# EAGLE design BluCoLight (EAGLE 6.5.0)
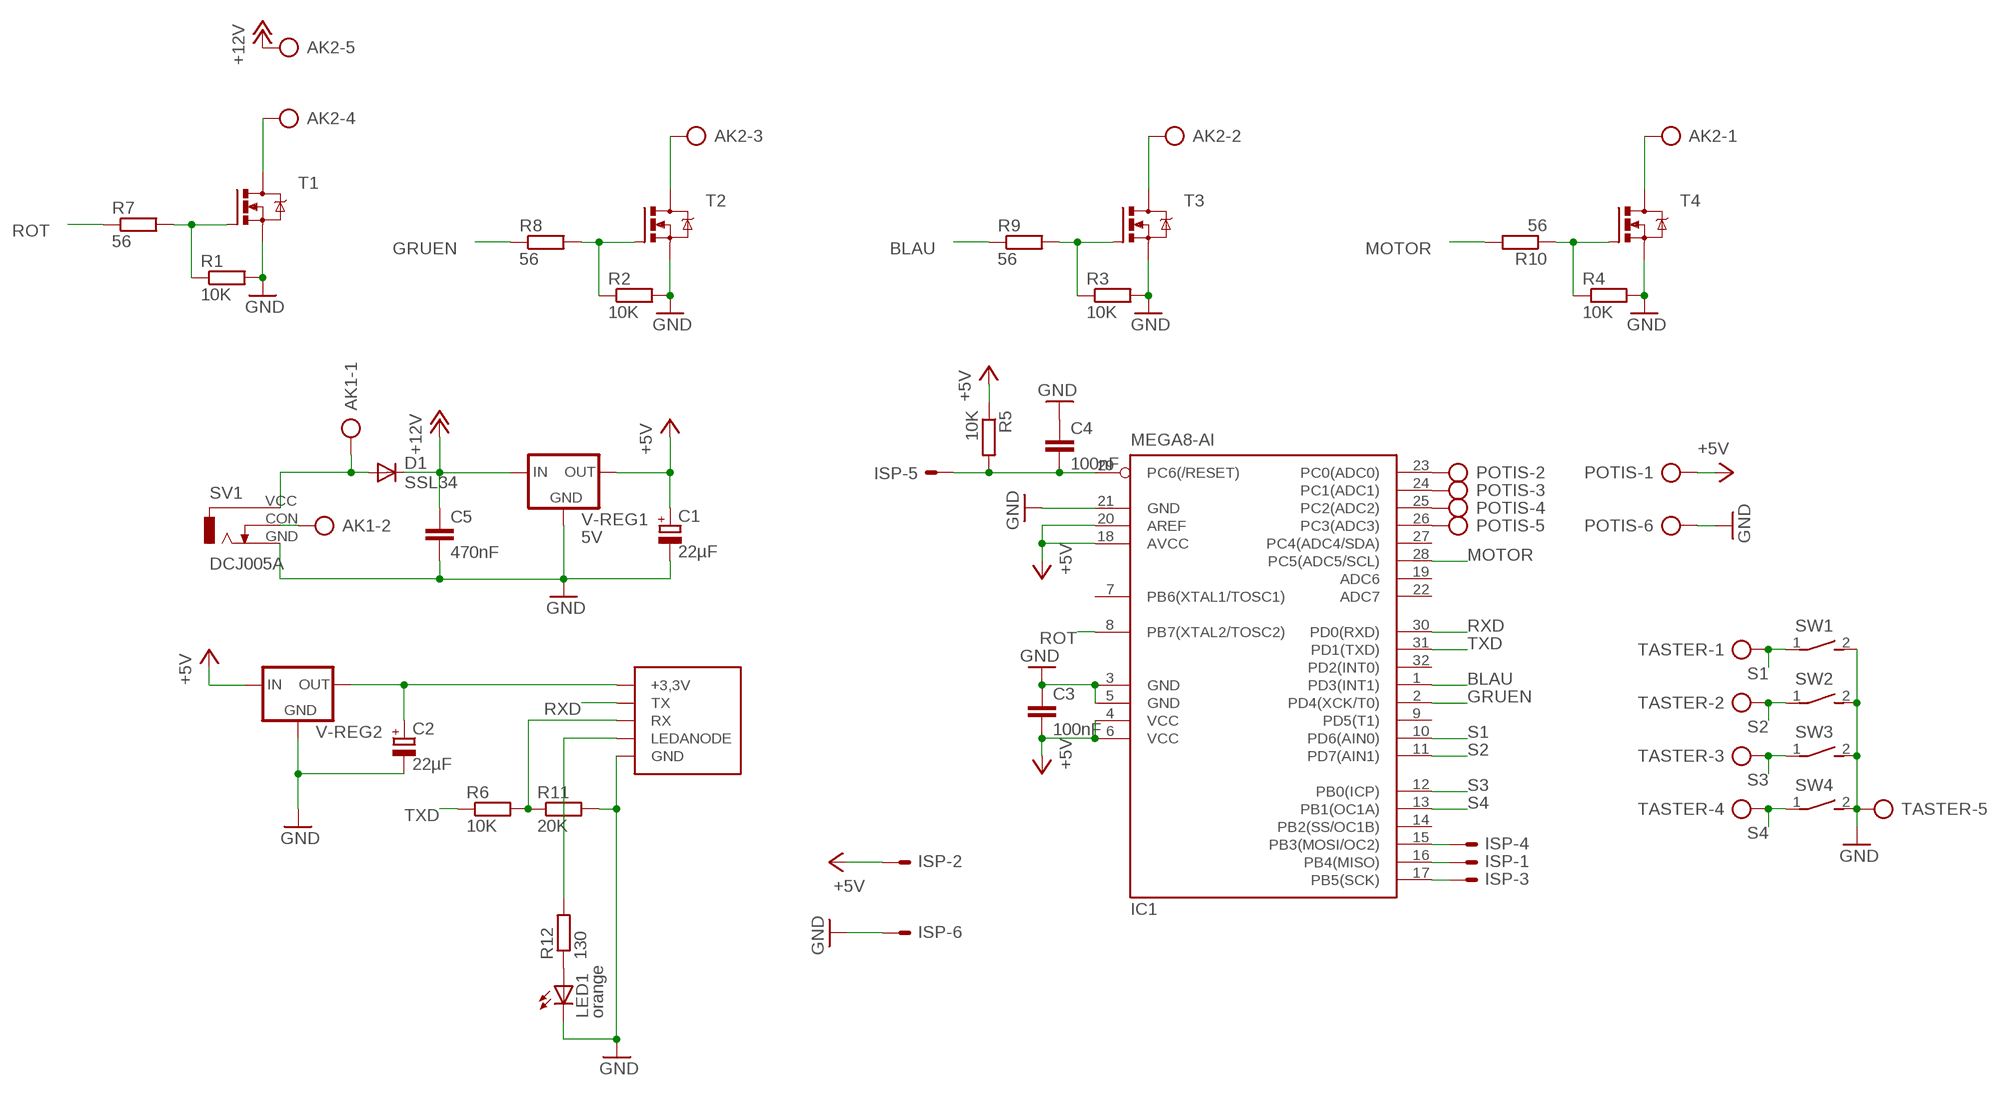
[diagram p0: schematic, sheet 1]

## Parts
AK1  AK2  [AK/2]
AK2  AK5AK/5  [AK/5]
C1  22µF  CPOL-EU153CLV-0605  [153CLV-0605]
C2  22µF  CPOL-EU153CLV-0605  [153CLV-0605]
C3  100nF  C-EUC0805K  [C0805K]
C4  100nF  C-EUC0805K  [C0805K]
C5  470nF  C-EUC1210K  [C1210K]
D1  SSL34  DIODE-SMC  [SMC]
HC-06  HC-06  [HC-06SMD]
IC1  MEGA8-AI  [TQFP32-08]
ISP  ML6E  [ML6]
LED1  orange  LEDCHIP-LED0603  [CHIP-LED0603]
POTIS  AK6PAD/6  [PAD/6]
R1  10K  R-EUR0603  [R0603]
R2  10K  R-EUR0603  [R0603]
R3  10K  R-EUR0603  [R0603]
R4  10K  R-EUR0603  [R0603]
R5  10K  R-EUR0603  [R0603]
R6  10K  R-EUR0603  [R0603]
R7  56  R-EUR0603  [R0603]
R8  56  R-EUR0603  [R0603]
R9  56  R-EUR0603  [R0603]
R10  56  R-EUR0603  [R0603]
R11  20K  R-EUR0603  [R0603]
R12  130  R-EUR0603  [R0603]
SV1  DCJ005A  [DC005A]
SW1  TASTER36SMD  [3*6*2.5SMD_TASTER]
SW2  TASTER36SMD  [3*6*2.5SMD_TASTER]
SW3  TASTER36SMD  [3*6*2.5SMD_TASTER]
SW4  TASTER36SMD  [3*6*2.5SMD_TASTER]
T1  IRLZ34NSPBFD2PACK  [D2PACK]
T2  IRLZ34NSPBFD2PACK  [D2PACK]
T3  IRLZ34NSPBFD2PACK  [D2PACK]
T4  IRLZ34NSPBFD2PACK  [D2PACK]
TASTER  AK5PAD/5  [PAD/5]
V-REG1  5V  53AP_L53B(LM2940CT5-SOT223)  [SOT223]
V-REG2  AMS1117-3.3SOT223  [SOT223]

## Nets
+5V: C1.+ C3.2 IC1.4(VCC) IC1.6(VCC) IC1.18(AVCC) IC1.20(AREF) ISP.2 POTIS.1 R5.1 V-REG1.3(OUT) V-REG2.3(IN)
+12V: AK2.5 C5.1 D1.C V-REG1.1(IN)
BLAU: IC1.1(PD3(INT1)) R9.1
GND: C1.- C2.- C3.1 C4.1 C5.2 HC-06.P$13(GND) HC-06.P$21(GND) HC-06.P$22(GND) IC1.3(GND) IC1.5(GND) IC1.21(GND) ISP.6 LED1.C POTIS.6 R1.2 R2.2 R3.2 R4.2 R11.2 SV1.GND SW1.2(S) SW2.2(S) SW3.2(S) SW4.2(S) T1.3(S) T2.3(S) T3.3(S) T4.3(S) TASTER.5 V-REG1.2(GND) V-REG1.4(GND) V-REG2.1(GND)
GRUEN: IC1.2(PD4(XCK/T0)) R8.1
MOTOR: IC1.28(PC5(ADC5/SCL)) R10.2
N$1: HC-06.P$24(LEDANODE) R12.2
N$2: C4.2 IC1.29(PC6(/RESET)) ISP.5 R5.2
N$3: R2.1 R8.2 T2.1(G)
N$4: IC1.15(PB3(MOSI/OC2)) ISP.4
N$5: R1.1 R7.2 T1.1(G)
N$6: AK2.4 T1.2(D)
N$7: AK2.3 T2.2(D)
N$8: R4.1 R10.1 T4.1(G)
N$9: IC1.16(PB4(MISO)) ISP.1
N$10: R3.1 R9.2 T3.1(G)
N$11: AK2.2 T3.2(D)
N$12: IC1.17(PB5(SCK)) ISP.3
N$13: AK2.1 T4.2(D)
N$14: HC-06.P$2(RX) R6.2 R11.1
N$15: LED1.A R12.1
N$16: IC1.23(PC0(ADC0)) POTIS.2
N$17: IC1.24(PC1(ADC1)) POTIS.3
N$18: C2.+ HC-06.P$12(+3,3V) V-REG2.2(OUT) V-REG2.4(OUT)
N$19: IC1.25(PC2(ADC2)) POTIS.4
N$20: IC1.26(PC3(ADC3)) POTIS.5
N$21: AK1.2 SV1.CON
N$25: AK1.1 D1.A SV1.VCC
ROT: IC1.8(PB7(XTAL2/TOSC2)) R7.1
RXD: HC-06.P$1(TX) IC1.30(PD0(RXD))
S1: IC1.10(PD6(AIN0)) SW1.1(P) TASTER.1
S2: IC1.11(PD7(AIN1)) SW2.1(P) TASTER.2
S3: IC1.12(PB0(ICP)) SW3.1(P) TASTER.3
S4: IC1.13(PB1(OC1A)) SW4.1(P) TASTER.4
TXD: IC1.31(PD1(TXD)) R6.1
Unconnected: IC1.7(PB6(XTAL1/TOSC1)) IC1.9(PD5(T1)) IC1.14(PB2(SS/OC1B)) IC1.19(ADC6) IC1.22(ADC7) IC1.27(PC4(ADC4/SDA)) IC1.32(PD2(INT0))

## Library data of the parts
AK1 = !Häufige Bauteile:AK2
AK2 TASTER = !Häufige Bauteile:AK5
C1 C2 = rcl:CPOL-EU: POLARIZED CAPACITOR, European symbol
C3-C5 = rcl:C-EU: CAPACITOR, European symbol
D1 = diode:DIODE-: DIODE
HC-06 = !Eigene Library SMD:HC-06
IC1 = atmel:MEGA8: MICROCONTROLLER 8 Kbytes FLASH, 1 kbytes SRAM, 512 bytes EEPROM, USART, 6-channel 10 bit ADC, 2-channel 8 bit ADC Pin compatible with Atmega48, ATMega88, ATMega168 Source: avr.lbr; MPN: ATMEGA8-16AU; OC_FARNELL: 9171371; OC_NEWARK: 73M8863
ISP = !Eigene Library SMD:ML6E
LED1 = led:LED: LED OSRAM: - CHIPLED LG R971, LG N971, LY N971, LG Q971, LY Q971, LO R971, LY R971 LH N974, LH R974 LS Q976, LO Q976, LY Q976 LO Q996 - Hyper CHIPLED LW Q18S LB Q993, LB Q99A, LB R99A - SideLED LS A670, LO A670, LY A670, LG A670, LP A670 LB A673, LV A673, LT A673, LW A673 LH A674 LY A675 LS A676, LA A676, LO A676, LY A676, LW A676 LS A679, LY A679, LG A679 - Hyper Micro SIDELED® LS Y876, LA Y876, LO Y876, LY Y876 LT Y87S - SmartLED LW L88C, LW L88S LB L89C, LB L89S, LG L890 LS L89K, LO L89K, LY L89K LS L896, LA L896, LO L896, LY L896 - TOPLED LS T670, LO T670, LY T670, LG T670, LP T670 LSG T670, LSP T670, LSY T670, LOP T670, LYG T670 LG T671, LOG T671, LSG T671 LB T673, LV T673, LT T673, LW T673 LH T674 LS T676, LA T676, LO T676, LY T676, LB T676, LH T676, LSB T676, LW T676 LB T67C, LV T67C, LT T67C, LS T67K, LO T67K, LY T67K, LW E67C LS E67B, LA E67B, LO E67B, LY E67B, LB E67C, LV E67C, LT E67C LW T67C LS T679, LY T679, LG T679 LS T770, LO T770, LY T770, LG T770, LP T770 LB T773, LV T773, LT T773, LW T773 LH T774 LS E675, LA E675, LY E675, LS T675 LS T776, LA T776, LO T776, LY T776, LB T776 LHGB T686 LT T68C, LB T68C - Hyper Mini TOPLED® LB M676 - Mini TOPLED Santana® LG M470 LS M47K, LO M47K, LY M47K Source: http://www.osram.convergy.de LUXEON: - LUMILED® LXK2-PW12-R00, LXK2-PW12-S00, LXK2-PW14-U00, LXK2-PW14-V00 LXK2-PM12-R00, LXK2-PM12-S00, LXK2-PM14-U00 LXK2-PE12-Q00, LXK2-PE12-R00, LXK2-PE12-S00, LXK2-PE14-T00, LXK2-PE14-U00 LXK2-PB12-K00, LXK2-PB12-L00, LXK2-PB12-M00, LXK2-PB14-N00, LXK2-PB14-P00, LXK2-PB14-Q00 LXK2-PR12-L00, LXK2-PR12-M00, LXK2-PR14-Q00, LXK2-PR14-R00 LXK2-PD12-Q00, LXK2-PD12-R00, LXK2-PD12-S00 LXK2-PH12-R00, LXK2-PH12-S00 LXK2-PL12-P00, LXK2-PL12-Q00, LXK2-PL12-R00 Source: www.luxeon.com KINGBRIGHT: KA-3528ASYC Source: www.kingbright.com
POTIS = !Häufige Bauteile:AK6
R1-R12 = !Eigene Library SMD:R-EU
SV1 = !Häufige Bauteile:DCJ005A: DC POWER JACK Source: DCJ0202.pdf; OC_FARNELL: unknown; OC_NEWARK: unknown
SW1-SW4 = !Eigene Library SMD:TASTER3*6SMD
T1-T4 = !Eigene Library SMD:IRLZ34NSPBF: IRLZ34 im D²PAK Gehäuse logic Level n-channel Mosfet Schaltet bei 12V max 2A
V-REG1 = !Eigene Library SMD:53AP_L53B(LM2940CT5-SOT223)
V-REG2 = !Eigene Library SMD:AMS1117-3.3SOT223

## Board
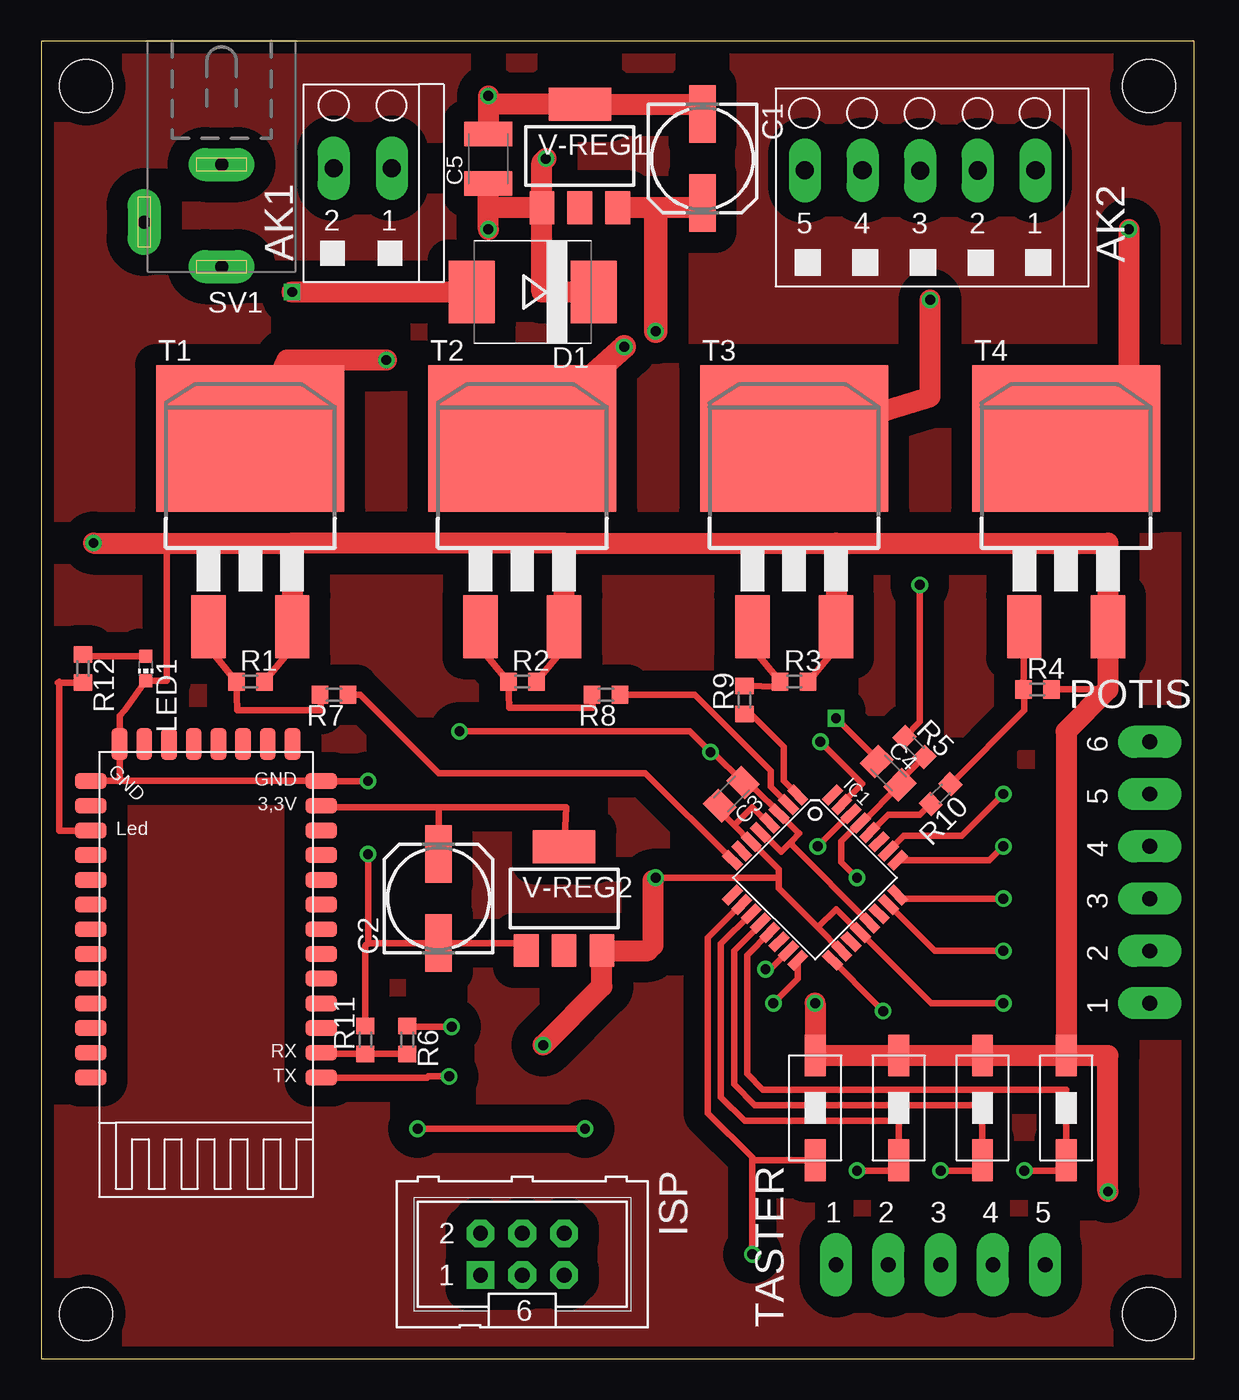
[diagram p1: board, top side]
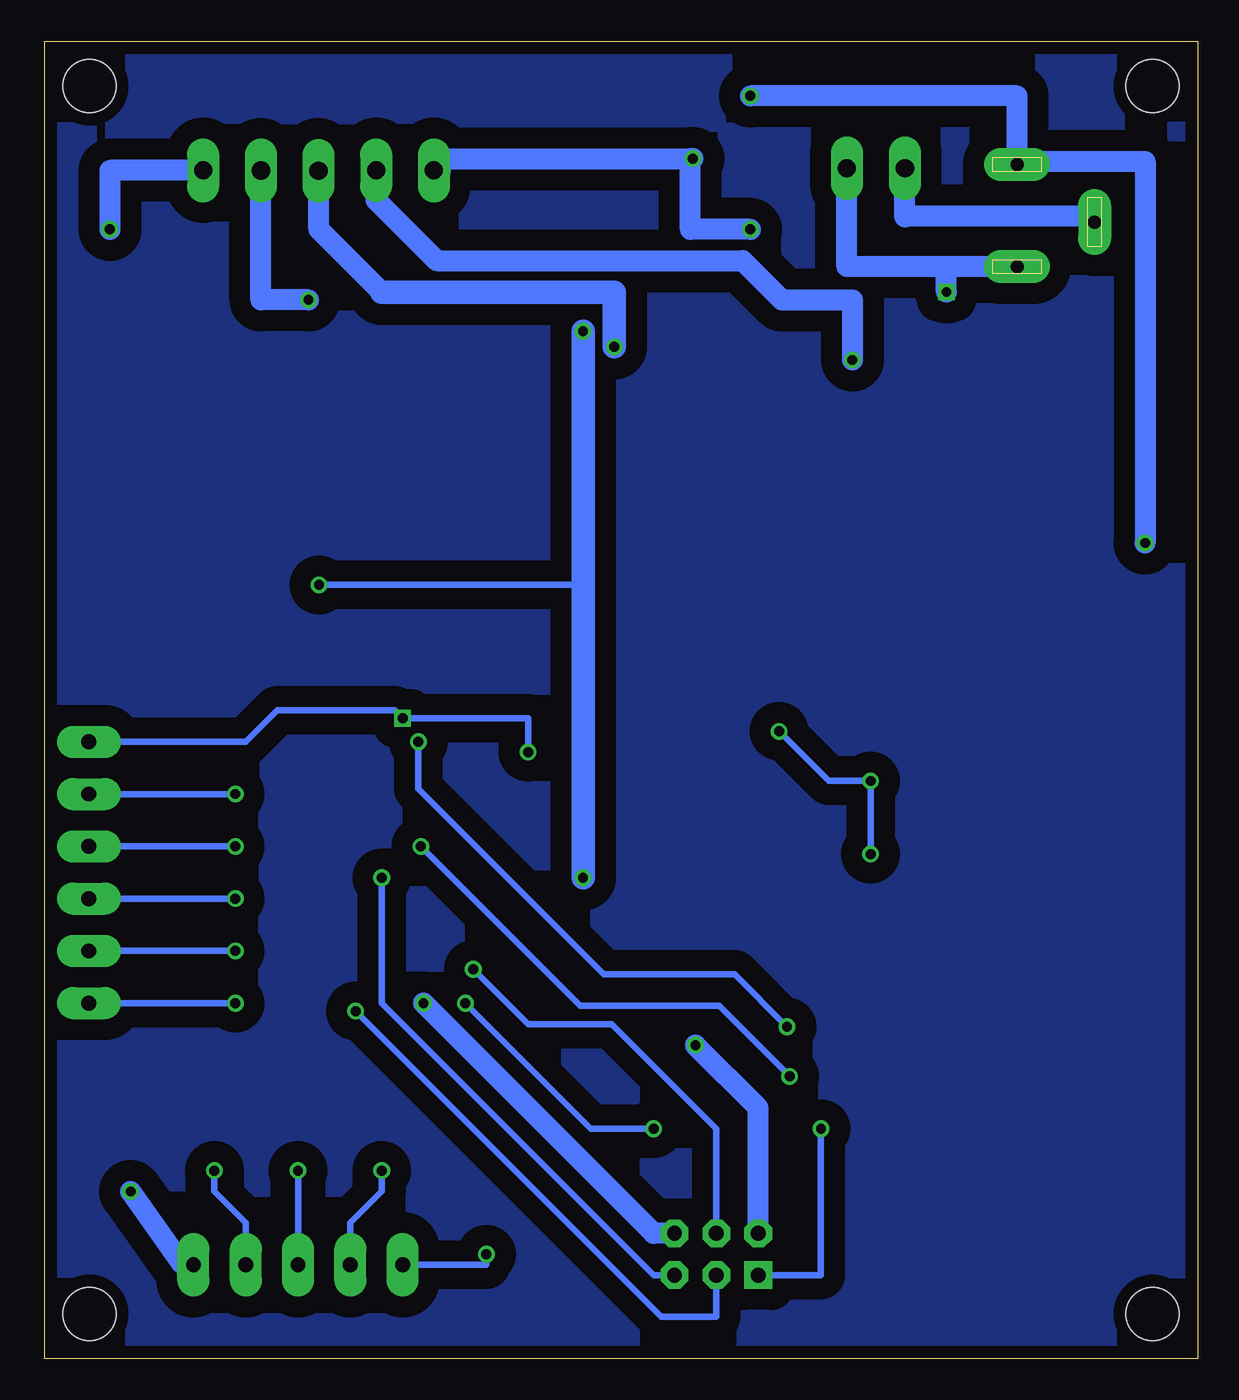
[diagram p2: board, bottom side, seen from below]

Size 70 x 80 mm. Coordinates in mm from the lower left corner, seen from the top.
Outline: 0,0 70,0 70,80 0,80 0,0
Copper layers (1*16): Top 0.035mm / dielectric 1.5mm / Bottom 0.035mm
Design rules "default *": minimum track width 10mil, minimum drill 23mil, track to track 50mil, track to pad 50mil, pad to pad 50mil, via to via 50mil, smd to smd 50mil, copper to edge 30mil, drill to drill 8mil, minimum pad ring 10mil, minimum via ring 8mil, stop-mask expansion 4mil, vias tented up to drill 0mil, thermal gap 10mil
Holes 3.2 mm at 2.73,77.27 67.27,77.27 67.27,2.73 2.73,2.73

### Footprints (pad centres in the part's own frame; a part is rotated, then mirrored left to right if it is on the bottom)
AK/2 = drill 1.1 pad 1.93 long: 1 1.605,1.17; 2 -1.925,1.17
AK/5 = drill 1.1 pad 1.93 long: 1 7.029,1.035; 2 3.521,1.025; 3 0.03,1.018; 4 -3.473,1.038; 5 -6.979,1.035
153CLV-0605 = smd 3.5 x 1.6: + 2.7,0; - -2.7,0
C0805K = smd 1.3 x 1.6: 1 -1,0; 2 1,0
C1210K = smd 1.5 x 2.9: 1 -1.5,0; 2 1.5,0
SMC = smd 2.8 x 3.8: A 3.7,0; C -3.7,0
HC-06SMD = smd 1.93 x 0.965: P$1 -6.85,8.32; P$2 -6.85,6.82; P$3 -6.85,5.32; P$4 -6.85,3.82; P$5 -6.85,2.32; P$6 -6.85,0.82; P$7 -6.85,-0.68; P$8 -6.85,-2.18; P$9 -6.85,-3.68; P$10 -6.85,-5.18; P$11 -6.85,-6.68; P$12 -6.85,-8.18; P$13 -6.85,-9.68; P$22 7.15,-9.68; P$23 7.15,-8.18; P$24 7.15,-6.68; P$25 7.15,-5.18; P$26 7.15,-3.68; P$27 7.15,-2.18; P$28 7.15,-0.68; P$29 7.15,0.82; P$30 7.15,2.32; P$31 7.15,3.82; P$32 7.15,5.32; P$33 7.15,6.82; P$34 7.15,8.32 | smd 0.965 x 1.93: P$14 -5.1,-11.93; P$15 -3.6,-11.93; P$16 -2.1,-11.93; P$17 -0.6,-11.93; P$18 0.9,-11.93; P$19 2.4,-11.93; P$20 3.9,-11.93; P$21 5.4,-11.93
TQFP32-08 = smd 1.27 x 0.559: 1 -4.293,2.8; 2 -4.293,2; 3 -4.293,1.2; 4 -4.293,0.4; 5 -4.293,-0.4; 6 -4.293,-1.2; 7 -4.293,-2; 8 -4.293,-2.8; 17 4.293,-2.8; 18 4.293,-2; 19 4.293,-1.2; 20 4.293,-0.4; 21 4.293,0.4; 22 4.293,1.2; 23 4.293,2; 24 4.293,2.8 | smd 0.559 x 1.27: 9 -2.8,-4.293; 10 -2,-4.293; 11 -1.2,-4.293; 12 -0.4,-4.293; 13 0.4,-4.293; 14 1.2,-4.293; 15 2,-4.293; 16 2.8,-4.293; 25 2.8,4.293; 26 2,4.293; 27 1.2,4.293; 28 0.4,4.293; 29 -0.4,4.293; 30 -1.2,4.293; 31 -2,4.293; 32 -2.8,4.293
ML6 = drill 0.9 pad 1.676 square: 1 -2.54,-1.27 | drill 0.9 pad 1.676 octagon: 2 -2.54,1.27; 3 0,-1.27; 4 0,1.27; 5 2.54,-1.27; 6 2.54,1.27
CHIP-LED0603 = smd 0.8 x 0.8: A 0,-0.75; C 0,0.75
PAD/6 = drill 0.9 pad 1.93 long: 1 -7.62,0; 2 -4.445,0; 3 -1.27,0; 4 1.905,0; 5 5.08,0; 6 8.255,0
R0603 = smd 1 x 1.1: 1 -0.85,0; 2 0.85,0
DC005A = drill 0.8 pad 2 long: CON 4.7,4.65; GND 0,1.15; VCC 0,7.35
3*6*2.5SMD_TASTER = smd 1.27 x 2.54: 1 0,-3.175; 2 0,3.175
D2PACK = smd 2.083 x 3.81: 1 -2.54,-8.89; 3 2.54,-8.89 | smd 11.43 x 8.89: 2 0,2.54
PAD/5 = drill 0.9 pad 1.93 long: 1 -6.35,0; 2 -3.175,0; 3 0,0; 4 3.175,0; 5 6.35,0
SOT223 = smd 1.5 x 2: 1 -2.3,-3.15; 2 0,-3.15; 3 2.3,-3.15 | smd 3.8 x 2: 4 0,3.15

### Placement (x,y rotation side)
AK1  19.68,71.12 0 top
AK2  53.34,71.12 0 top
C1  40.15,72.87 270 top
C2  24.13,27.94 90 top
C3  41.91,34.29 225 top
C4  51.44,35.56 315 top
C5  27.15,72.87 90 top
D1  29.84,64.77 180 top
HC-06  10.16,25.4 180 top
IC1  46.99,29.21 315 top
ISP  29.21,6.35 0 top
LED1  6.35,41.91 180 top
POTIS  67.31,29.21 90 top
R1  12.7,41.12 0 top
R2  29.21,41.12 0 top
R3  45.72,41.12 0 top
R4  60.48,40.64 0 top
R5  53.02,37.15 315 top
R6  22.23,19.37 270 top
R7  17.78,40.32 180 top
R8  34.29,40.32 180 top
R9  42.7,40.01 90 top
R10  54.61,34.29 225 top
R11  19.68,19.37 90 top
R12  2.54,41.91 270 top
SV1  10.95,73.66 180 top
SW1  46.99,15.24 0 top
SW2  52.07,15.24 0 top
SW3  57.15,15.24 0 top
SW4  62.23,15.24 0 top
T1  12.7,53.34 0 top
T2  29.21,53.34 0 top
T3  45.72,53.34 0 top
T4  62.23,53.34 0 top
TASTER  54.61,5.71 0 top
V-REG1  32.7,73.03 0 top
V-REG2  31.75,27.94 0 top

### Tracks (layer width: path | path; a pad name or v marks a point on that pad's centre or on a via)
+5V  (via drill 0.6)
  Top 0.406: 44.31,32.53 IC1.4 44.15,32.53 43.18,33.5 42.07,32.38 | IC1.18 48.58,24.76 47.15,26.19 | 47.15,26.19 44.77,28.57 44.77,29.21 | 44.77,29.21 44.77,29.73 IC1.6 43.06,31.4 42.07,32.38 | 47.15,26.19 48.26,27.3 49.67,25.89 IC1.20 54.04,21.59 v58.42,21.59 | 42.07,32.38 41.43,33.02 41.43,33.35 C3.2 | v37.31,29.21 44.77,29.21 | R5.1 53.34,38.67 v53.34,46.99
  Top 1.016: 36.85,24.79 37.15,25.08 | 37.15,29.05 v37.31,29.21
  Top 1.27: 36.85,24.79 V-REG2.3 34.05,22.62 v30.48,19.05 | 37.15,25.08 37.15,29.05 | 37.3,69.7 37.3,69.88 | 37.3,69.88 V-REG1.3 | C1.+ 40.15,69.88 37.3,69.88
  Top 1.422: 37.3,69.7 37.31,68.9 v37.31,62.39
  Bottom 0.406: POTIS.1 v58.42,21.59 | v53.34,46.99 37.31,46.99
  Bottom 1.27: ISP.2 26.67,15.24 v30.48,19.05
  Bottom 1.422: v37.31,62.39 37.31,46.99 v37.31,29.21
+12V  (via drill 0.6)
  Top 1.27: V-REG1.1 27.15,69.88 | 27.15,69.88 C5.1 | v27.15,68.58 27.15,69.88 | V-REG1.1 30.4,72.63 v30.64,72.87 | D1.C 30.4,64.77 V-REG1.1
  Bottom 1.27: AK2.5 45.95,72.16 45.88,72.87 30.8,72.87 | v30.64,72.87 30.8,72.87 | v27.15,68.58 30.8,68.58 30.8,72.87
BLAU
  Top 0.406: IC1.1 45.09,35.08 45.09,37.15 43.02,39.21 43.02,39.16 R9.1
GND  (via drill 0.6)
  Top 0.406: R4.2 64.77,40.64 | R3.2 48.26,43.18 T3.3 | C4.1 50.73,36.43 v48.26,38.89 | R2.2 31.75,43.18 T2.3 | R1.2 15.24,43.18 T1.3 | V-REG2.1 29,25.24 C2.- | 19.84,25.24 C2.- | C2.- 19.84,25.24 | 19.84,25.24 v19.84,30.64 | v19.84,35.08 HC-06.P$13 | HC-06.P$21 4.76,36.06 | 4.76,36.06 4.76,39.05 5.08,39.37 LED1.C 7.62,41.16 7.62,49.53 | R11.2 19.68,25.08 19.84,25.24 | 62.23,23.34 62.23,19.05 SW4.2 | 16.99,35.08 4.76,35.08 | 2.7,35.08 4.76,35.08 | 4.76,35.08 4.76,36.06 | IC1.5 43.76,31.96 44.93,30.8 45.56,31.43 | 45.56,31.43 46.04,31.91 45.99,31.91 IC1.3 44.8,33.14 43.34,34.61 43.01,34.61 C3.1 40.78,36.83 v40.64,36.83 39.37,38.1 v25.4,38.1 | 45.56,31.43 45.56,31.2 IC1.21
  Top 1.27: v64.77,10.16 64.77,18.41 SW4.2 SW3.2 SW2.2 SW1.2 v46.99,21.59 | v27.15,76.68 27.15,76.17 | 27.15,76.17 C5.2 | 27.15,76.17 V-REG1.4 40.15,76.17 C1.- | v3.17,49.53 7.62,49.53 15.24,49.53 | T2.3 31.75,49.53 | 31.75,49.53 15.24,49.53 | 15.24,49.53 T1.3 | 31.75,49.53 48.26,49.53 | 48.26,49.53 64.77,49.53 T4.3 64.77,40.64 62.23,38.1 62.23,19.05 | 48.26,49.53 T3.3
  Bottom 0.406: v19.84,30.64 v19.84,35.08 22.38,35.08 v25.4,38.1 | v40.64,36.83 40.64,38.89 v48.26,38.89 48.74,39.37 55.88,39.37 57.78,37.47 POTIS.6
  Bottom 1.27: ISP.6 33.02,7.62 v46.99,21.59 | TASTER.5 61.59,5.71 v64.77,10.16 | SV1.GND 10.95,72.71 | 10.95,72.71 10.95,76.68 v27.15,76.68 | 10.95,72.71 3.17,72.71 v3.17,49.53
GRUEN
  Top 0.406: IC1.2 44.29,34.74 44.29,35.72 39.69,40.32 R8.1
MOTOR
  Top 0.406: IC1.28 50.38,31.96 51.44,33.02 53.34,33.02 R10.2
N$1
  Top 0.406: HC-06.P$24 2.86,32.07 1.11,32.07 1.11,41.12 1.01,41.06 R12.2
N$2  (via drill 0.6)
  Top 0.406: R5.2 52.14,35.06 C4.2 49.82,32.53 IC1.29 49.67,32.53 48.58,31.43 48.58,30.16 v49.53,29.21
  Bottom 0.406: ISP.5 33.02,5.08 49.53,21.59 v49.53,29.21
N$3
  Top 0.406: T2.1 26.67,43.18 R2.1 28.42,39.53 33.5,39.53 R8.2
N$4  (via drill 0.6)
  Top 0.406: v43.97,23.65 44.26,23.65 IC1.15
  Bottom 0.406: ISP.4 29.21,13.97 35.56,20.32 40.64,20.32 v43.97,23.65
N$5
  Top 0.406: T1.1 10.16,43.18 R1.1 11.91,39.37 16.99,39.37 R7.2
N$6  (via drill 0.6)
  Top 1.27: v20.95,60.64 14.92,60.64 T1.2
  Bottom 1.27: AK2.4 49.87,70.35 46.2,66.67 27.62,66.67 25.24,64.29 20.95,64.29 v20.95,60.64
N$7  (via drill 0.6)
  Top 1.422: T2.2 v35.4,61.44
  Bottom 1.27: 49.53,64.77 53.34,68.58 53.34,72.11 AK2.3
  Bottom 1.422: v35.4,61.44 35.4,64.77 49.53,64.77
N$8
  Top 0.406: T4.1 59.69,43.18 R4.1 59.69,40.11 59.69,39.37 R10.1
N$9  (via drill 0.6)
  Top 0.406: IC1.16 45.94,23.07 v44.45,21.59 | v33.02,13.97 v22.86,13.97
  Bottom 0.406: ISP.1 22.86,5.08 v22.86,13.97 | v44.45,21.59 36.83,13.97 v33.02,13.97
N$10
  Top 0.406: T3.1 43.18,43.18 R3.1 44.77,41.12 44.77,40.8 R9.2
N$11  (via drill 0.6)
  Top 1.27: T3.2 53.98,58.42 v53.98,64.29
  Bottom 1.27: v53.98,64.29 56.86,64.29 AK2.2
N$12  (via drill 0.6)
  Top 0.406: IC1.17 50.65,21.59 v51.12,21.11
  Bottom 0.406: ISP.3 29.21,2.54 32.54,2.54 v51.12,21.11
N$13  (via drill 0.6)
  Top 1.27: v66.04,68.58 66.04,58.42 T4.2
  Bottom 1.27: AK2.1 66.04,72.16 v66.04,68.58
N$14
  Top 0.406: HC-06.P$2 17.07,18.52 R11.1 R6.2
N$15
  Top 0.406: R12.1 2.64,42.66 LED1.A
N$16  (via drill 0.6)
  Top 0.406: v58.42,24.77 54.26,24.77 IC1.23
  Bottom 0.406: POTIS.2 v58.42,24.77
N$17  (via drill 0.6)
  Top 0.406: IC1.24 52.22,27.94 v58.42,27.94
  Bottom 0.406: v58.42,27.94 POTIS.3
N$18
  Top 0.406: HC-06.P$12 17.09,33.5 24.13,33.5 | 24.13,33.5 C2.+ | V-REG2.4 31.88,33.5 24.13,33.5
N$19  (via drill 0.6)
  Top 0.406: v58.42,31.11 57.57,30.27 IC1.25
  Bottom 0.406: POTIS.4 v58.42,31.11
N$20  (via drill 0.6)
  Top 0.406: IC1.26 52.36,31.75 55.88,31.75 v58.42,34.29
  Bottom 0.406: v58.42,34.29 POTIS.5
N$21
  Bottom 1.27: SV1.CON 6.25,69.28 6.35,69.37 17.78,69.37 17.76,69.33 AK1.2
N$22
  Top 0.406: 50.16,26.51 50.16,26.67
N$23
  pour Top: 0,80.01 69.85,80.01 69.85,0 0,0
N$24
  pour Bottom: 0,80.01 69.85,80.01 69.85,0 0,0
N$25  (via drill 0.6)
  Top 1.27: D1.A v15.24,64.77
  Bottom 1.27: SV1.VCC 15.24,66.31 | 15.24,66.31 21.29,66.31 AK1.1 | v15.24,64.77 15.24,66.31
ROT
  Top 0.406: IC1.8 36.68,35.56 24.13,35.56 19.37,40.32 R7.1
RXD  (via drill 0.6)
  Top 0.406: HC-06.P$1 23.43,17.08 23.5,17.14 v24.77,17.14 | IC1.30 49.13,33.09 v47.15,31.11
  Bottom 0.406: v47.15,31.11 37.47,21.43 29.05,21.43 v24.77,17.14
S1  (via drill 0.6)
  Top 0.406: SW1.1 43.18,12.06 | 43.18,12.06 43.18,12.22 40.48,14.92 40.48,25.56 42.51,27.59 IC1.10 | v43.18,6.35 43.18,12.06
  Bottom 0.406: TASTER.1 43.18,5.71 v43.18,6.35
S2  (via drill 0.6)
  Top 0.406: IC1.11 41.27,25.19 41.27,15.88 42.7,14.45 52.07,14.45 SW2.1 51.44,11.43 v49.53,11.43
  Bottom 0.406: TASTER.2 51.44,8.26 49.53,10.16 v49.53,11.43
S3  (via drill 0.6)
  Top 0.406: IC1.12 43.67,26.37 42.07,24.77 42.07,16.67 43.34,15.4 57.15,15.4 SW3.1 57.15,11.43 v54.61,11.43
  Bottom 0.406: TASTER.3 v54.61,11.43
S4  (via drill 0.6)
  Top 0.406: IC1.13 42.86,24.52 42.86,17.3 43.81,16.35 62.23,16.35 SW4.1 61.59,11.43 v59.69,11.43
  Bottom 0.406: TASTER.4 57.78,8.26 59.69,10.16 v59.69,11.43
TXD  (via drill 0.6)
  Top 0.406: IC1.31 48.61,33.69 49.85,34.92 v47.31,37.47 | R6.1 22.28,20.16 v24.92,20.16
  Bottom 0.406: v47.31,37.47 47.31,34.61 36.04,23.34 28.1,23.34 v24.92,20.16

### Text on the board
Document: GND | +12V | +12V | Rot | Grün | Blau | Motor | + | GND | A3 | + | A2 | A1 | A0 | +5V | HC-06 | Rot | Grün | Blau | Motor | BlueCoLight / T. Stuckenberg / 07.04.2016 | Rot | Grün | Blau | Motor | GND | ISP
bDocu: copyright Tobias Stuckenberg / bluecolight@pinundport.de